# EAGLE design ACC (EAGLE 9.5.2)
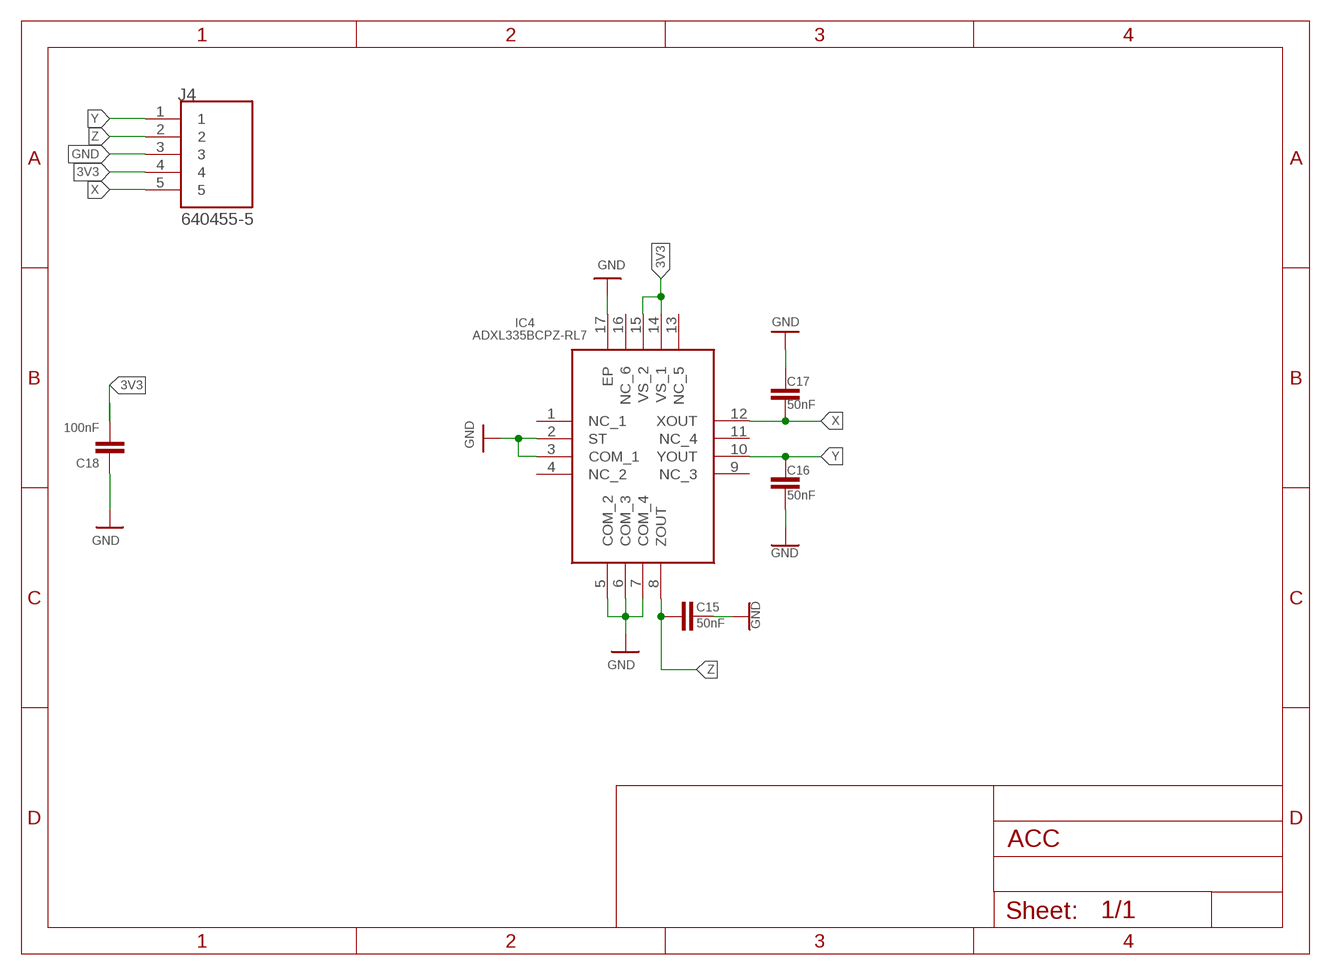
[diagram p0: schematic, sheet 1]

## Parts
C15  50nF  C-EUC0603  [C0603]
C16  50nF  C-EUC0603  [C0603]
C17  50nF  C-EUC0603  [C0603]
C18  100nF  C-EUC0603  [C0603]
IC4  ADXL335BCPZ-RL7  [QFN65P400X400X150-17N]
J4  640455-5  [TE_640455-5]

## Nets
3V3: C18.2 IC4.14(VS_1) IC4.15(VS_2) J4.4
GND: C15.1 C16.2 C17.1 C18.1 IC4.2(ST) IC4.3(COM_1) IC4.5(COM_2) IC4.6(COM_3) IC4.7(COM_4) IC4.17(EP) J4.3
X: C17.2 IC4.12(XOUT) J4.5
Y: C16.1 IC4.10(YOUT) J4.1
Z: C15.2 IC4.8(ZOUT) J4.2
Unconnected: IC4.1(NC_1) IC4.4(NC_2) IC4.9(NC_3) IC4.11(NC_4) IC4.13(NC_5) IC4.16(NC_6)

## Library data of the parts
C15-C18 = rcl:C-EU: CAPACITOR, European symbol; SPICEPREFIX: C
IC4 = SamacSys_Parts:ADXL335BCPZ-RL7: Accelerometer IC Source: Datasheet <https://componentsearchengine.com/Datasheets/1/ADXL335BCPZ-RL7.pdf>; DESCRIPTION: Accelerometer IC; HEIGHT: 1.5mm; MANUFACTURER_NAME: Analog Devices; MANUFACTURER_PART_NUMBER: ADXL335BCPZ-RL7; MOUSER_PART_NUMBER: 584-ADXL335BCPZ-R7; MOUSER_PRICE-STOCK: https://www.mouser.com/Search/Refine.aspx?Keyword=584-ADXL335BCPZ-R7
J4 = 640455-5:640455-5; COMMENT: 640455-5; DESCRIPTION: MTA-100 5 Position Through Hole Single Row Right Angle Wire to Board Header; DIGI-KEY_PART_NUMBER: A19453-ND; DIGI-KEY_PURCHASE_URL: https://www.digikey.de/product-detail/en/te-connectivity-amp-connectors/640455-5/A19453-ND/259000?utm_source=snapeda&utm_medium=aggregator&utm_campaign=symbol; MF: TE Connectivity; MP: 640455-5; PACKAGE: None; TE_PURCHASE_URL: https://www.te.com/usa-en/product-640455-5.html?te_bu=Cor&te_type=disp&te_campaign=seda_glo_cor-seda-global-disp-prtnr-fy19-seda-model-bom-cta_sma-317_1&elqCampaignId=32493

## Board
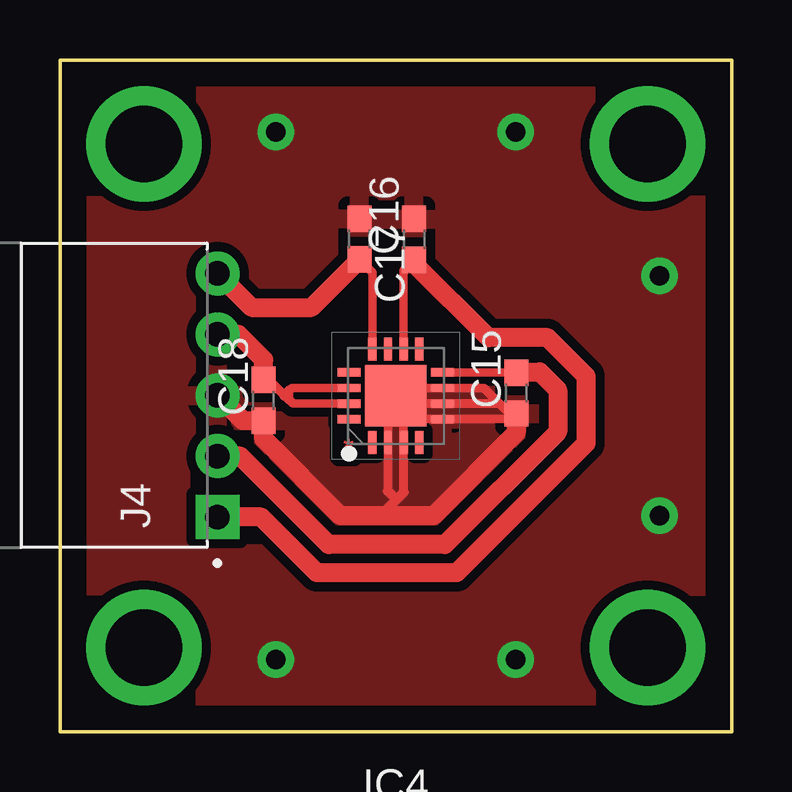
[diagram p1: board, top side]
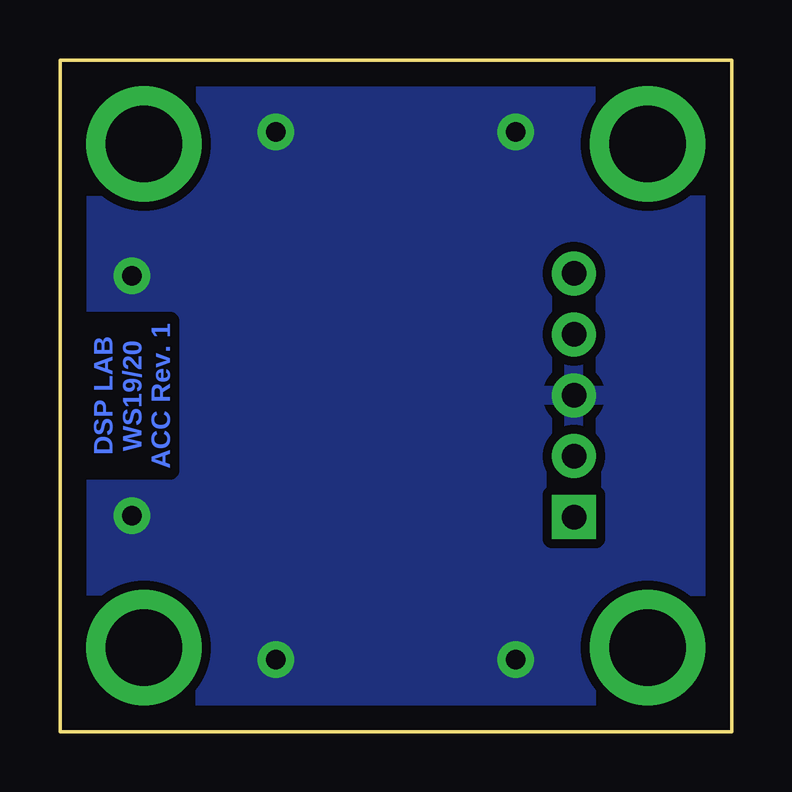
[diagram p2: board, bottom side, seen from below]

Size 28 x 28 mm. Coordinates in mm from the lower left corner, seen from the top.
Outline: 0,0 28,0 28,28 0,28 0,0
Copper layers (1*16): Top 0.035mm / dielectric 1.5mm / Bottom 0.035mm
Design rules "Projektlabor_THT_DRC_2019 *": minimum track width 0.35mm, minimum drill 0.6mm, track to track 15mil, track to pad 12mil, pad to pad 16mil, via to via 20mil, smd to smd 8mil, copper to edge 40mil, drill to drill 16mil, minimum pad ring 16mil, minimum via ring 14mil, stop-mask expansion 4mil, vias tented up to drill 0mil, thermal gap 15mil

### Footprints (pad centres in the part's own frame; a part is rotated, then mirrored left to right if it is on the bottom)
C0603 = smd 1.1 x 1: 1 -0.85,0; 2 0.85,0
QFN65P400X400X150-17N = smd 0.95 x 0.35: 1 -1.95,0.975; 2 -1.95,0.325; 3 -1.95,-0.325; 4 -1.95,-0.975; 9 1.95,-0.975; 10 1.95,-0.325; 11 1.95,0.325; 12 1.95,0.975 | smd 0.35 x 0.95: 5 -0.975,-1.95; 6 -0.325,-1.95; 7 0.325,-1.95; 8 0.975,-1.95; 13 0.975,1.95; 14 0.325,1.95; 15 -0.325,1.95; 16 -0.975,1.95 | smd 2.55 x 2.55: 17 0,0
TE_640455-5 = drill 1.02 pad 1.37 square: 1 0,0 | drill 1.02 pad 1.37: 2 -2.54,0; 3 -5.08,0; 4 -7.62,0; 5 -10.16,0

### Placement (x,y rotation side)
C15  19.03,14.11 90 top
C16  14.77,20.52 90 top
C17  12.48,20.53 270 top
C18  8.49,13.81 90 top
IC4  14,14 90 top
J4  6.57,8.94 270 top

### Tracks (layer width: path | path; a pad name or v marks a point on that pad's centre or on a via)
3V3
  Top 0.35: IC4.14 9.68,14.32 9.55,14.2 9.55,13.85 9.72,13.68 IC4.15 | C18.2 8.71,14.66
  Top 0.4: 8.71,14.66 9.36,14.01
  Top 0.406: 9.55,14.2 9.36,14.01 9.39,14.01 9.55,13.85
  Top 0.8: C18.2 8.49,15.51 7.44,16.56 J4.4
DRILL1  (via drill 3.2 pad 4.8)
  other vias: 3.5,3.5
DRILL2  (via drill 3.2 pad 4.8)
  other vias: 3.5,24.5
DRILL3  (via drill 3.2 pad 4.8)
  other vias: 24.5,24.5
DRILL4  (via drill 3.2 pad 4.8)
  other vias: 24.5,3.5
GND  (via drill 0.8 pad 1.5)
  Top 0.35: 18.8,13.03 IC4.5 14.97,13.03 IC4.17 | 18.32,13.68 IC4.6 14.32,13.68 | 18.32,13.68 18.88,13.12 | 18.32,13.68 17.68,14.32 IC4.7 14.32,14.32 IC4.17 | 13.68,10.03 IC4.2 13.68,13.68 IC4.17 | 14.32,9.97 IC4.3 14.32,13.68 | 14.32,13.68 IC4.17
  Top 0.406: 18.8,13.03 18.88,13.12 C15.1 | 13.68,10.03 14.03,9.68 | 14.03,9.68 14.32,9.97 | 14.03,9.68 13.35,9
  Top 0.8: C15.1 19.03,12.46 15.57,9 13.35,9 11.7,9 8.49,12.21 C18.1 7.63,12.96 J4.3
  other vias: 9,3 19,3 25,9 25,19 19,25 9,25
  pour Top: -17.42,45.5 50.5,45.5 50.5,-15.6 -18.11,-15.6
  pour Bottom: -16,43.5 48,43.5 48,-13.5 -16,-13.5
X
  Top 0.35: IC4.12 13.03,19.13 C17.2
  Top 0.8: C17.2 10.48,17.68 7.99,17.68 J4.5
Y
  Top 0.35: IC4.10 14.32,19.23 C16.1
  Top 0.8: C16.1 14.77,19.52 17.87,16.42 20.33,16.42 21.93,14.82 21.93,12.01 16.54,6.62 10.71,6.62 8.39,8.94 J4.1
Z
  Top 0.35: IC4.8 19.02,14.97
  Top 0.406: 19.02,14.97 C15.2
  Top 0.8: C15.2 19.07,15 20,15 20.75,14.25 20.75,12.5 16.05,7.8 11.2,7.8 7.52,11.48 J4.2

### Text on the board
Top: *
Bottom: DSP LAB / WS19/20 / ACC Rev. 1
Measures: Bohrung: Durchmesser 3.2mm / Maße und Bohrung für alle vier Löcher gleich